# Altium schematic sheet Flex_Sensor_ADC.SchDoc
size A4; SheetNumber: 9; SheetTotal: 9
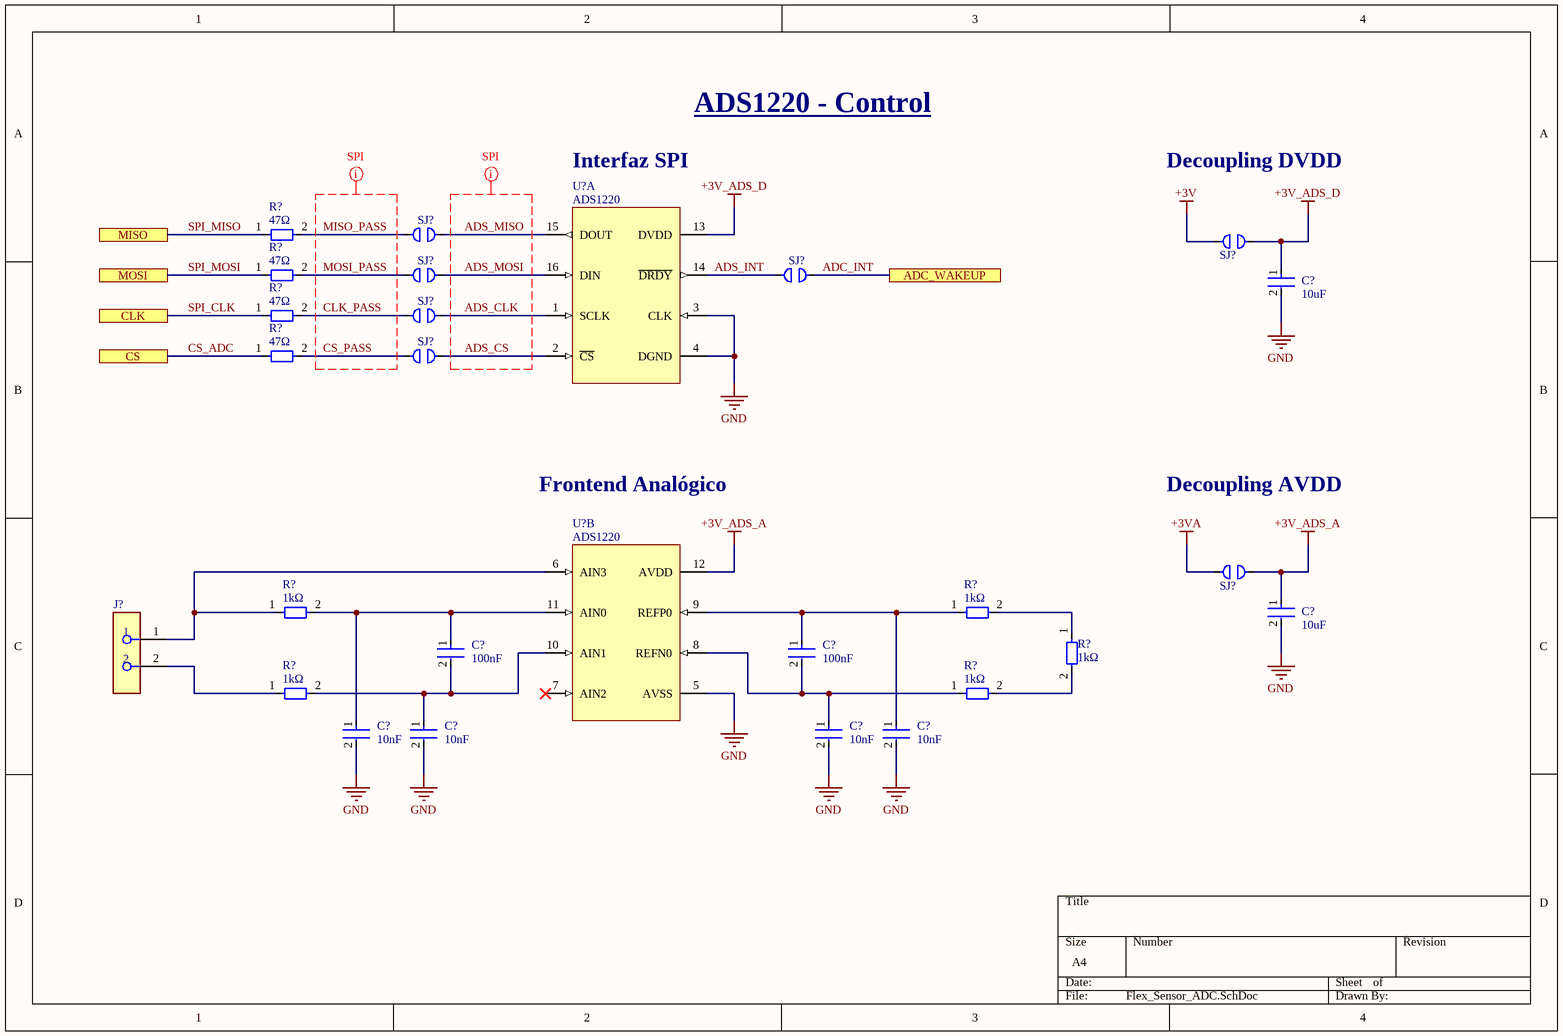
[diagram p0: Flex_Sensor_ADC.SchDoc]

## Parts
(Parts that share a designator on the sheet are numbered #1, #2 ... from top to bottom, then left to right.)
C?#1  Capacitance: 10uF  [C_0805]  (hidden comment: Simbolo de capacitor genérico)
C?#2  Capacitance: 10uF  [C_0805]  (hidden comment: Simbolo de capacitor genérico)
C?#3  Capacitance: 100nF  [C_0805]  (hidden comment: Simbolo de capacitor genérico)
C?#4  Capacitance: 100nF  [C_0805]  (hidden comment: Simbolo de capacitor genérico)
C?#5  Capacitance: 10nF  [C_0805]  (hidden comment: Simbolo de capacitor genérico)
C?#6  Capacitance: 10nF  [C_0805]  (hidden comment: Simbolo de capacitor genérico)
C?#7  Capacitance: 10nF  [C_0805]  (hidden comment: Simbolo de capacitor genérico)
C?#8  Capacitance: 10nF  [C_0805]  (hidden comment: Simbolo de capacitor genérico)
J?  PPTC021LGBN-RC  [FP-PPTC021LGBN-RC-MFG]  (value not drawn)
R?#1  value 47Ω  [R_0805]  (hidden comment: Simbolo de resistencia genérica)
R?#2  value 47Ω  [R_0805]  (hidden comment: Simbolo de resistencia genérica)
R?#3  value 47Ω  [R_0805]  (hidden comment: Simbolo de resistencia genérica)
R?#4  value 47Ω  [R_0805]  (hidden comment: Simbolo de resistencia genérica)
R?#5  value 1kΩ  [R_0805]  (hidden comment: Simbolo de resistencia genérica)
R?#6  value 1kΩ  [R_0805]  (hidden comment: Simbolo de resistencia genérica)
R?#7  value 1kΩ  [R_0805]  (hidden comment: Simbolo de resistencia genérica)
R?#8  value 1kΩ  [R_0805]  (hidden comment: Simbolo de resistencia genérica)
R?#9  value 1kΩ  [R_0805]  (hidden comment: Simbolo de resistencia genérica)
SJ?#1  Solder Jumper for bridge  [R_0805 - Jumper]  (value not drawn)  (no BOM)
SJ?#2  Solder Jumper for bridge  [R_0805 - Jumper]  (value not drawn)  (no BOM)
SJ?#3  Solder Jumper for bridge  [R_0805 - Jumper]  (value not drawn)  (no BOM)
SJ?#4  Solder Jumper for bridge  [R_0805 - Jumper]  (value not drawn)  (no BOM)
SJ?#5  Solder Jumper for bridge  [R_0805 - Jumper]  (value not drawn)  (no BOM)
SJ?#6  Solder Jumper for bridge  [R_0805 - Jumper]  (value not drawn)  (no BOM)
SJ?#7  Solder Jumper for bridge  [R_0805 - Jumper]  (value not drawn)  (no BOM)
U?#1  ADS1220  [TSSOP-16]  (part A of 2)
U?#2  ADS1220  [TSSOP-16]  (part B of 2)

## Ports
ADC_WAKEUP, CLK, CS, MISO, MOSI

## Nets
+3V: SJ?#2.1
+3V_ADS_A: C?#2.1 SJ?#7.2 U?#2.12(AVDD)
+3V_ADS_D: C?#1.1 SJ?#2.2 U?#1.13(DVDD)
+3VA: SJ?#7.1
GND: C?#1.2 C?#2.2 C?#5.2 C?#6.2 C?#7.2 C?#8.2 U?#1.3(CLK) U?#1.4(DGND) U?#2.5(AVSS)
ADC_INT: SJ?#4.2 ; port ADC_WAKEUP
ADS_CLK: SJ?#5.2 U?#1.1(SCLK)
ADS_CS: SJ?#6.2 U?#1.2(~{CS})
ADS_INT: SJ?#4.1 U?#1.14(~{DRDY})
ADS_MISO: SJ?#1.2 U?#1.15(DOUT)
ADS_MOSI: SJ?#3.2 U?#1.16(DIN)
CLK_PASS: R?#3.2 SJ?#5.1
CS_ADC: R?#4.1 ; port CS
CS_PASS: R?#4.2 SJ?#6.1
MISO_PASS: R?#1.2 SJ?#1.1
MOSI_PASS: R?#2.2 SJ?#3.1
SPI_CLK: R?#3.1 ; port CLK
SPI_MISO: R?#1.1 ; port MISO
SPI_MOSI: R?#2.1 ; port MOSI
NetC?#3_1: C?#3.1 C?#5.1 R?#5.2 U?#2.11(AIN0)
NetC?#3_2: C?#3.2 C?#6.1 R?#8.2 U?#2.10(AIN1)
NetC?#4_1: C?#4.1 C?#8.1 R?#6.1 U?#2.9(REFP0)
NetC?#4_2: C?#4.2 C?#7.1 R?#9.1 U?#2.8(REFN0)
NetJ?_1: J?.1 R?#5.1 U?#2.6(AIN3)
NetJ?_2: J?.2 R?#8.1
NetR?#6_2: R?#6.2 R?#7.1
NetR?#7_2: R?#7.2 R?#9.2

Not connected (* = marked no-connect by the designer): U?#2 7(AIN2)*

## Layout directives
net class SPI: ADS_CLK, ADS_CS, ADS_MISO, ADS_MOSI, CLK_PASS, CS_PASS, MISO_PASS, MOSI_PASS

## Notes on the sheet
- ADS1220 - Control
- Interfaz SPI
- Decoupling DVDD
- Frontend Analógico
- Decoupling AVDD

## Library data of the parts
C?#1-C?#8 = Generic C: Dielectric: X5R; Voltage Rating: 10V; Tolerance: 10%; Case Code (Imperial): 0805; Mount: Surface Mount; Depth: 1.25mm; Length: 2mm; Lead Free: Lead Free; Packaging: Tape and Reel; Width: 0.049inch; Package Quantity: 1; Height: 1.25mm; Case/Package: 0805; Thickness: 0.053inch; Max Operating Temperature: 85°C; Case Code (Metric): 2012; Contact Plating: Tin; Min Operating Temperature: -55°C; Radiation Hardening: No; Voltage Rating (DC): 10V
J? = CMP-00595-00270342-1: PPTC021LGBN-RC 2 Position Total Single Row 2.54 mm Pitch Right Angle Female Header; NexarPartId: 270342; Pitch: 2.54mm; Current Rating: 3A; Number of Positions: 2; Voltage Rating: 250V; Connector Type: Header, Socket; Lead Free: Lead Free; Height: 2.4mm; Contact Material: Bronze, Nickel, Tin; Color: Black; RoHS: Compliant; Width: 8.5mm; Min Operating Temperature: -40°C; Housing Color: Black; Max Operating Temperature: 105°C; Termination: Solder; Mount: Through Hole; Packaging: Bulk; Contact Plating: Tin; Number of Rows: 1; Housing Material: Plastic; Length: 5.58mm; Number of Contacts: 2
R?#1-R?#9 = Generic R
SJ?#1-SJ?#7 = Solder Jumper
U?#1 U?#2 = ADS1220: ADS1220 4-Channel, 2-kSPS, Low-Power, 24-Bit ADC with Integrated PGA and Reference